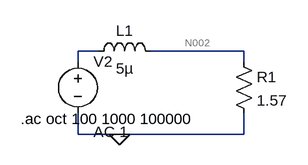
[diagram p0: schematic Draft13.asc]
Draft13.asc, the LTspice schematic file:
Version 4
SHEET 1 1040 680
WIRE 0 96 -32 96
WIRE 224 96 80 96
WIRE -32 112 -32 96
WIRE 224 112 224 96
WIRE -32 224 -32 192
WIRE 32 224 -32 224
WIRE 224 224 224 192
WIRE 224 224 32 224
FLAG 32 224 0
SYMBOL ind -16 112 R270
WINDOW 0 32 56 VTop 2
WINDOW 3 5 56 VBottom 2
SYMATTR InstName L1
SYMATTR Value 5µ
SYMBOL res 208 96 R0
SYMATTR InstName R1
SYMATTR Value 1.57
SYMBOL voltage -32 96 R0
WINDOW 123 24 124 Left 2
WINDOW 39 0 0 Left 2
SYMATTR InstName V2
SYMATTR Value ""
SYMATTR Value2 AC 1
TEXT -120 200 Left 2 !.ac oct 100 1000 100000

The netlist it stands for:
* Draft13.asc
L1 N001 N002 5µ
R1 N002 0 1.57
V2 N001 0 AC 1
.ac oct 100 1000 100000
.backanno
.end

* Results of the author's LTspice run, read from the files saved beside the schematic
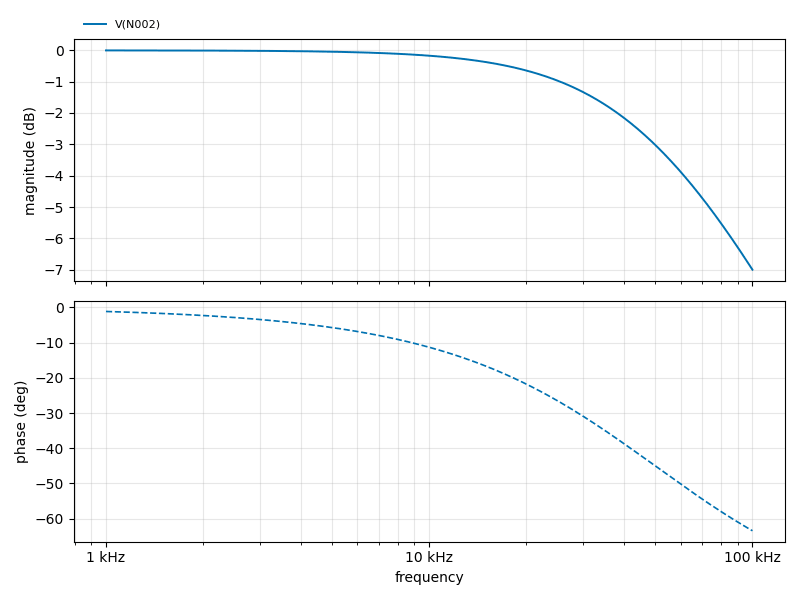
[diagram p1: AC Analysis of Draft13.asc, plotted from the saved traces]
* AC Analysis, 1 run:
*   V(N002): -0.01 dB at 1 kHz, -6.99 dB at 100 kHz, peak -0.01 dB at 1 kHz, 3 dB below the peak at 50.03 kHz